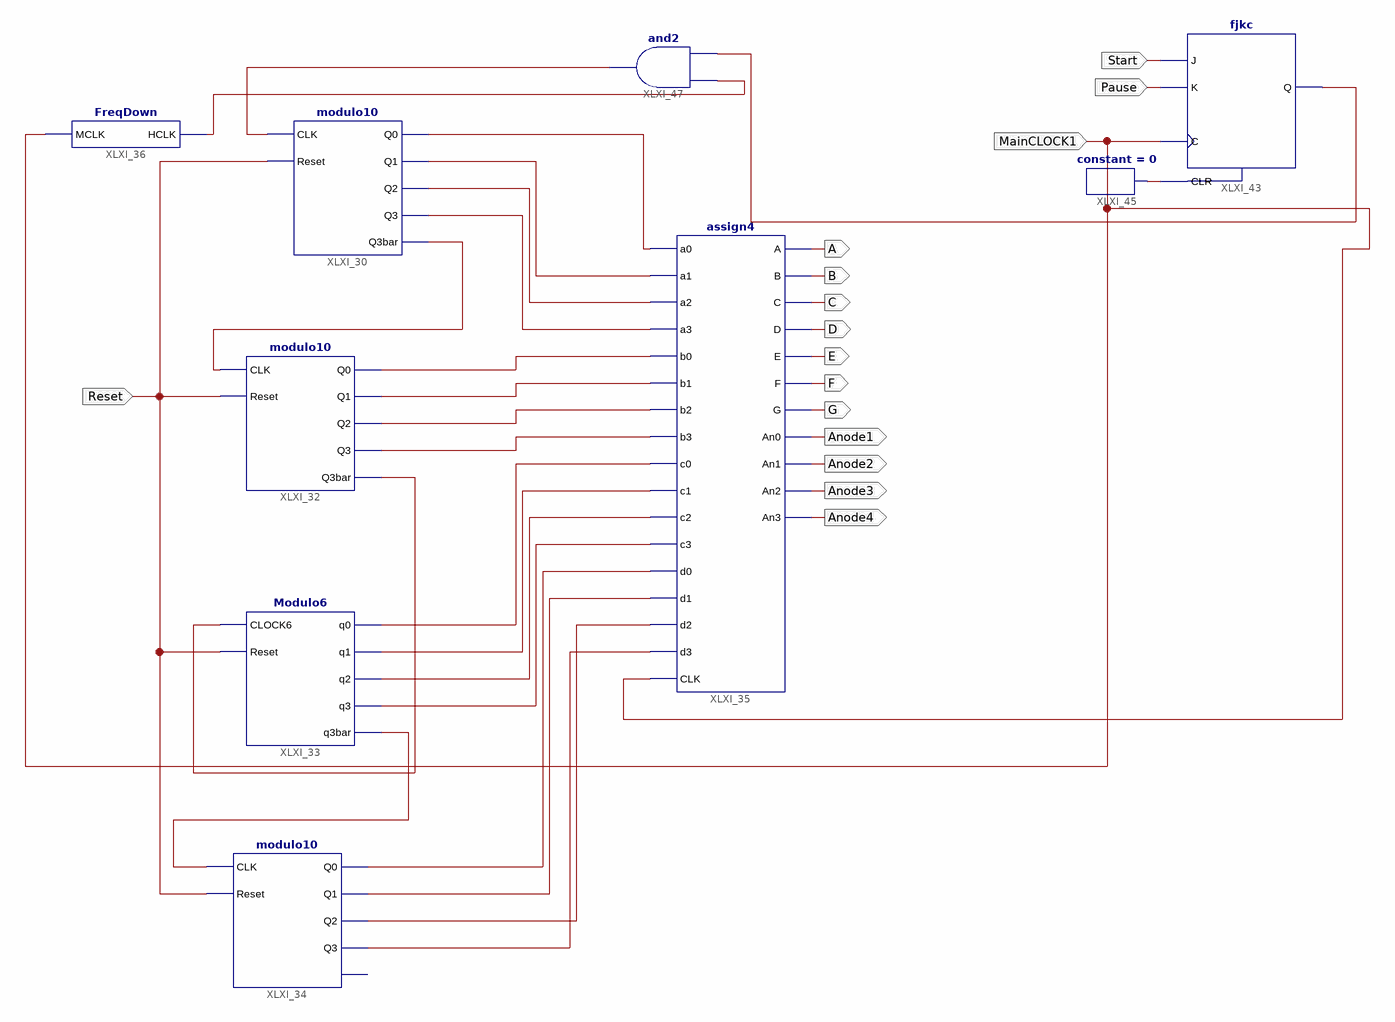
[diagram p0: schematic sheet 1]
// Xilinx ISE schematic assign5.sch (spartan6) as structural Verilog: 9 symbols, 15 ports
module assign5 (
  input  Start,
  input  Pause,
  input  MainCLOCK1,
  input  Reset,
  output A,
  output B,
  output C,
  output D,
  output E,
  output F,
  output G,
  output Anode1,
  output Anode2,
  output Anode3,
  output Anode4
);

  wire XLXN_40, XLXN_41, XLXN_42, XLXN_43, XLXN_44, XLXN_45, XLXN_46, XLXN_47, XLXN_48, XLXN_49, XLXN_50,
       XLXN_51, XLXN_52, XLXN_53, XLXN_54, XLXN_55, XLXN_56, XLXN_57, XLXN_58, XLXN_77, XLXN_87, XLXN_89,
       XLXN_98;

  modulo10 XLXI_30 (
    .CLK(XLXN_98), .Q0(XLXN_43), .Q1(XLXN_44), .Q2(XLXN_45), .Q3(XLXN_46), .Q3bar(XLXN_40), .Reset(Reset));
  modulo10 XLXI_32 (
    .CLK(XLXN_40), .Q0(XLXN_47), .Q1(XLXN_48), .Q2(XLXN_49), .Q3(XLXN_50), .Q3bar(XLXN_41), .Reset(Reset));
  Modulo6 XLXI_33 (
    .CLOCK6(XLXN_41), .q0(XLXN_51), .q1(XLXN_52), .q2(XLXN_53), .q3(XLXN_54), .q3bar(XLXN_42), .Reset(Reset));
  modulo10 XLXI_34 (
    .CLK(XLXN_42), .Q0(XLXN_55), .Q1(XLXN_56), .Q2(XLXN_57), .Q3(XLXN_58), .Reset(Reset));  // open: Q3bar
  assign4 XLXI_35 (
    .A(A), .a0(XLXN_43), .a1(XLXN_44), .a2(XLXN_45), .a3(XLXN_46), .An0(Anode1), .An1(Anode2), .An2(Anode3),
    .An3(Anode4), .B(B), .b0(XLXN_47), .b1(XLXN_48), .b2(XLXN_49), .b3(XLXN_50), .C(C), .c0(XLXN_51),
    .c1(XLXN_52), .c2(XLXN_53), .c3(XLXN_54), .CLK(MainCLOCK1), .D(D), .d0(XLXN_55), .d1(XLXN_56),
    .d2(XLXN_57), .d3(XLXN_58), .E(E), .F(F), .G(G));
  FreqDown XLXI_36 (.HCLK(XLXN_89), .MCLK(MainCLOCK1));
  fjkc XLXI_43 (.C(MainCLOCK1), .CLR(XLXN_77), .J(Start), .K(Pause), .Q(XLXN_87));
  constant #(.CValue("0")) XLXI_45 (.O(XLXN_77));
  and XLXI_47 (XLXN_98, XLXN_89, XLXN_87);
endmodule
